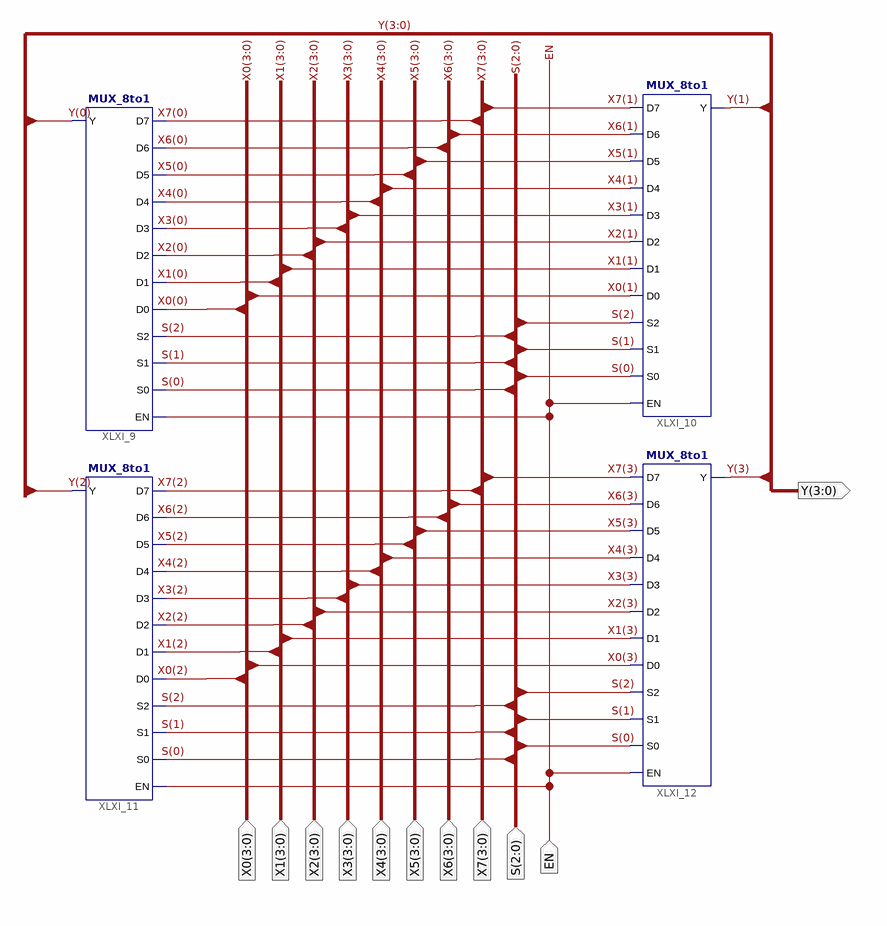
[diagram p0: schematic sheet 1]
// Xilinx ISE schematic Mux_8way_4bit.sch (spartan3e) as structural Verilog: 4 symbols, 11 ports
module Mux_8way_4bit (
  input  [3:0] X5,
  input  [3:0] X6,
  input  [3:0] X0,
  input  [3:0] X7,
  input  [3:0] X2,
  input  [3:0] X3,
  input  [3:0] X4,
  input  [3:0] X1,
  input  [2:0] S,
  input  EN,
  output [3:0] Y
);

  MUX_8to1 XLXI_9 (
    .D0(X0[0]), .D1(X1[0]), .D2(X2[0]), .D3(X3[0]), .D4(X4[0]), .D5(X5[0]), .D6(X6[0]), .D7(X7[0]), .EN(EN),
    .S0(S[0]), .S1(S[1]), .S2(S[2]), .Y(Y[0]));
  MUX_8to1 XLXI_10 (
    .D0(X0[1]), .D1(X1[1]), .D2(X2[1]), .D3(X3[1]), .D4(X4[1]), .D5(X5[1]), .D6(X6[1]), .D7(X7[1]), .EN(EN),
    .S0(S[0]), .S1(S[1]), .S2(S[2]), .Y(Y[1]));
  MUX_8to1 XLXI_11 (
    .D0(X0[2]), .D1(X1[2]), .D2(X2[2]), .D3(X3[2]), .D4(X4[2]), .D5(X5[2]), .D6(X6[2]), .D7(X7[2]), .EN(EN),
    .S0(S[0]), .S1(S[1]), .S2(S[2]), .Y(Y[2]));
  MUX_8to1 XLXI_12 (
    .D0(X0[3]), .D1(X1[3]), .D2(X2[3]), .D3(X3[3]), .D4(X4[3]), .D5(X5[3]), .D6(X6[3]), .D7(X7[3]), .EN(EN),
    .S0(S[0]), .S1(S[1]), .S2(S[2]), .Y(Y[3]));
endmodule
